# EAGLE design display_driver (EAGLE 7.2.0)
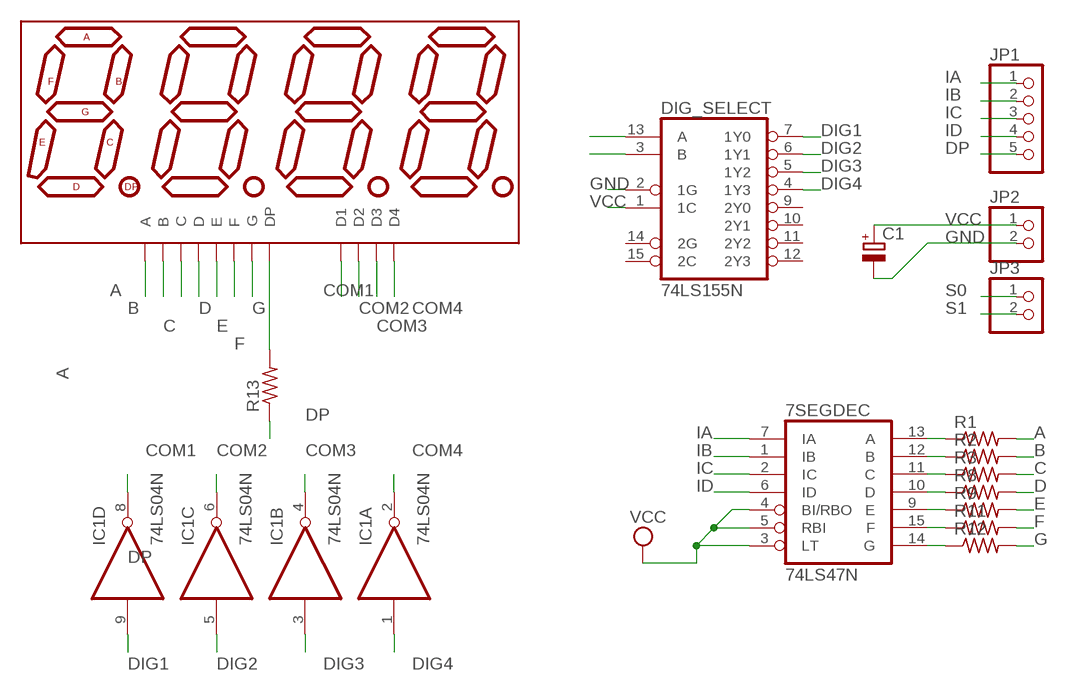
[diagram p0: schematic, sheet 1]

## Parts
7SEGDEC  74LS47N  [DIL16]
C1  CPOL-EUE2-5  [E2-5]
DIG_SELECT  74LS155N  [DIL16]
DISP1  7-SEGMENT-4DIGIT-COUNTERCL5642BH-33  [4DIG_CA]
IC1  74LS04N  [DIL14]
JP1  PINHD-1X5  [1X05]
JP2  PINHD-1X2  [1X02]
JP3  PINHD-1X2  [1X02]
R1  R-US_0204/7  [0204/7]
R2  R-US_0204/7  [0204/7]
R3  R-US_0204/7  [0204/7]
R8  R-US_0204/7  [0204/7]
R9  R-US_0204/7  [0204/7]
R11  R-US_0204/7  [0204/7]
R12  R-US_0204/7  [0204/7]
R13  R-US_0204/7  [0204/7]

## Nets
A: DISP1.A R1.2
B: DISP1.B R2.2
C: DISP1.C R3.2
COM1: DISP1.COM1(D1) IC1.8(D:O)
COM2: DISP1.COM2(D2) IC1.6(C:O)
COM3: DISP1.COM3(D3) IC1.4(B:O)
COM4: DISP1.COM4(D4) IC1.2(A:O)
D: DISP1.D R8.2
DIG1: DIG_SELECT.7(1Y0) IC1.9(D:I)
DIG2: DIG_SELECT.6(1Y1) IC1.5(C:I)
DIG3: DIG_SELECT.5(1Y2) IC1.3(B:I)
DIG4: DIG_SELECT.4(1Y3) IC1.1(A:I)
DP: JP1.5 R13.1
E: DISP1.E R9.2
F: DISP1.F R11.2
G: DISP1.G R12.2
GND: C1.- DIG_SELECT.2(1G) JP2.2
IA: 7SEGDEC.7(IA) JP1.1
IB: 7SEGDEC.1(IB) JP1.2
IC: 7SEGDEC.2(IC) JP1.3
ID: 7SEGDEC.6(ID) JP1.4
N$3: 7SEGDEC.15(F) R11.1
N$4: DISP1.DP R13.2
N$5: 7SEGDEC.13(A) R1.1
N$9: 7SEGDEC.12(B) R2.1
N$10: 7SEGDEC.11(C) R3.1
N$11: 7SEGDEC.10(D) R8.1
N$12: 7SEGDEC.9(E) R9.1
N$13: 7SEGDEC.14(G) R12.1
S0: DIG_SELECT.13(A) JP3.1
S1: DIG_SELECT.3(B) JP3.2
VCC: 7SEGDEC.3(LT) 7SEGDEC.4(BI/RBO) 7SEGDEC.5(RBI) C1.+ DIG_SELECT.1(1C) JP2.1
Unconnected: DIG_SELECT.9(2Y0) DIG_SELECT.10(2Y1) DIG_SELECT.11(2Y2) DIG_SELECT.12(2Y3) DIG_SELECT.14(2G) DIG_SELECT.15(2C) IC1.10(E:O) IC1.11(E:I) IC1.12(F:O) IC1.13(F:I)

## Power pins joined to a net without a drawn wire
GND: 7SEGDEC.8(GND) DIG_SELECT.8(GND) IC1.7(P:GND)
VCC: 7SEGDEC.16(VCC) DIG_SELECT.16(VCC) IC1.14(P:VCC)

## Library data of the parts
7SEGDEC = 74xx-eu:74*47: BCD to seven segment DECODER/DRIVER Source: http://www.ee.washington.edu/stores/DataSheets/74ls/74ls47.pdf
C1 = rcl:CPOL-EU: POLARIZED CAPACITOR, European symbol
DIG_SELECT = 74xx-eu:74*155: Dual 2-line to 4-line data DECODER/DEMULTIPLEXER
DISP1 = SparkFun-Displays:7-SEGMENT-4DIGIT-COUNTER
IC1 = 74xx-eu:74*04: Hex INVERTER
JP1 = pinhead:PINHD-1X5: PIN HEADER
JP2 JP3 = pinhead:PINHD-1X2: PIN HEADER
R1-R3 R8 R9 R11-R13 = resistor:R-US_: RESISTOR, American symbol

## Board
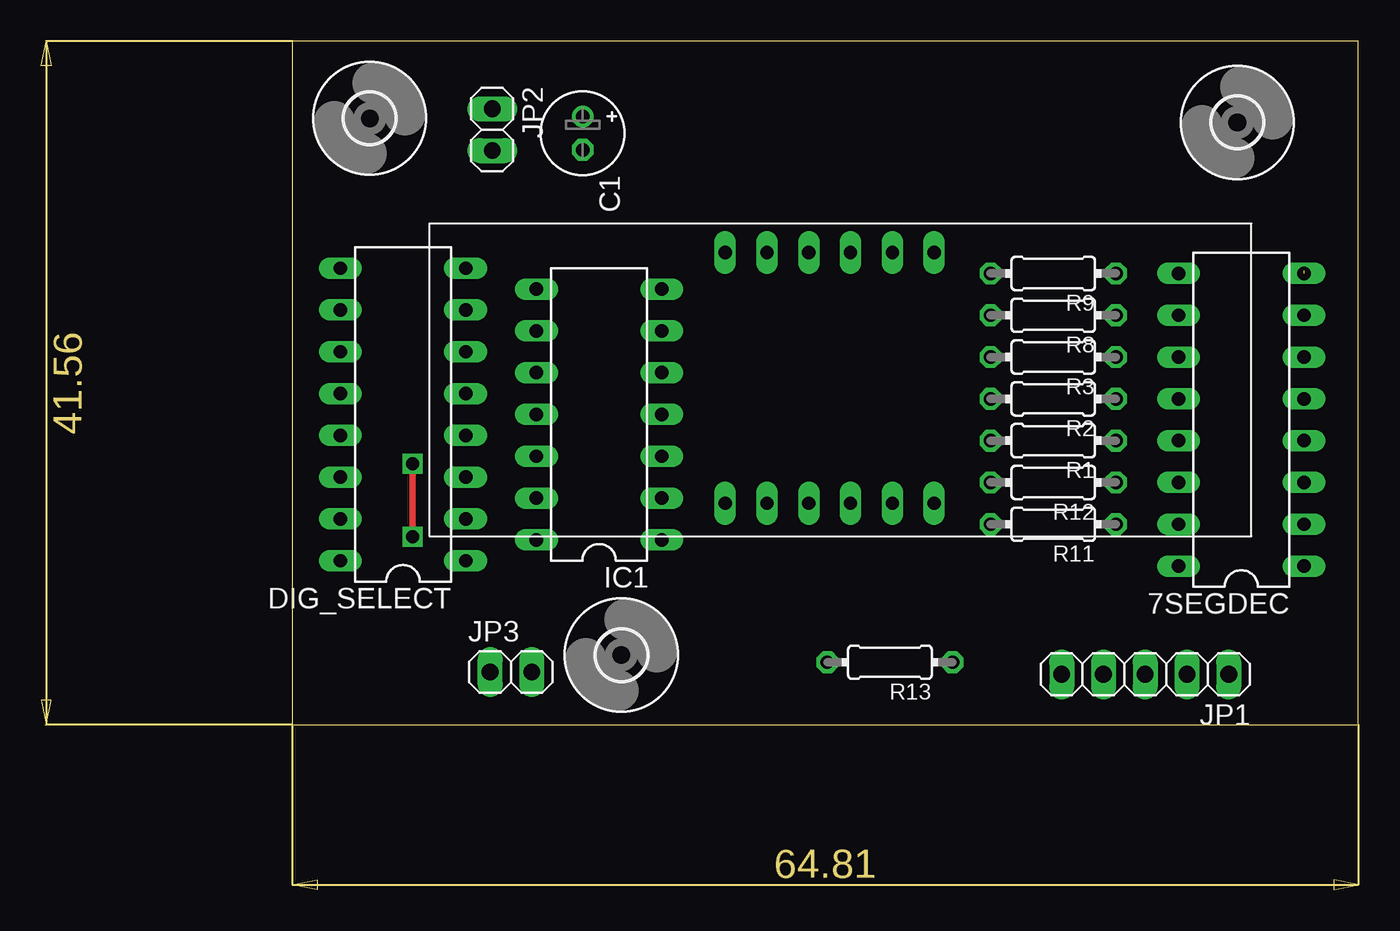
[diagram p1: board, top side]
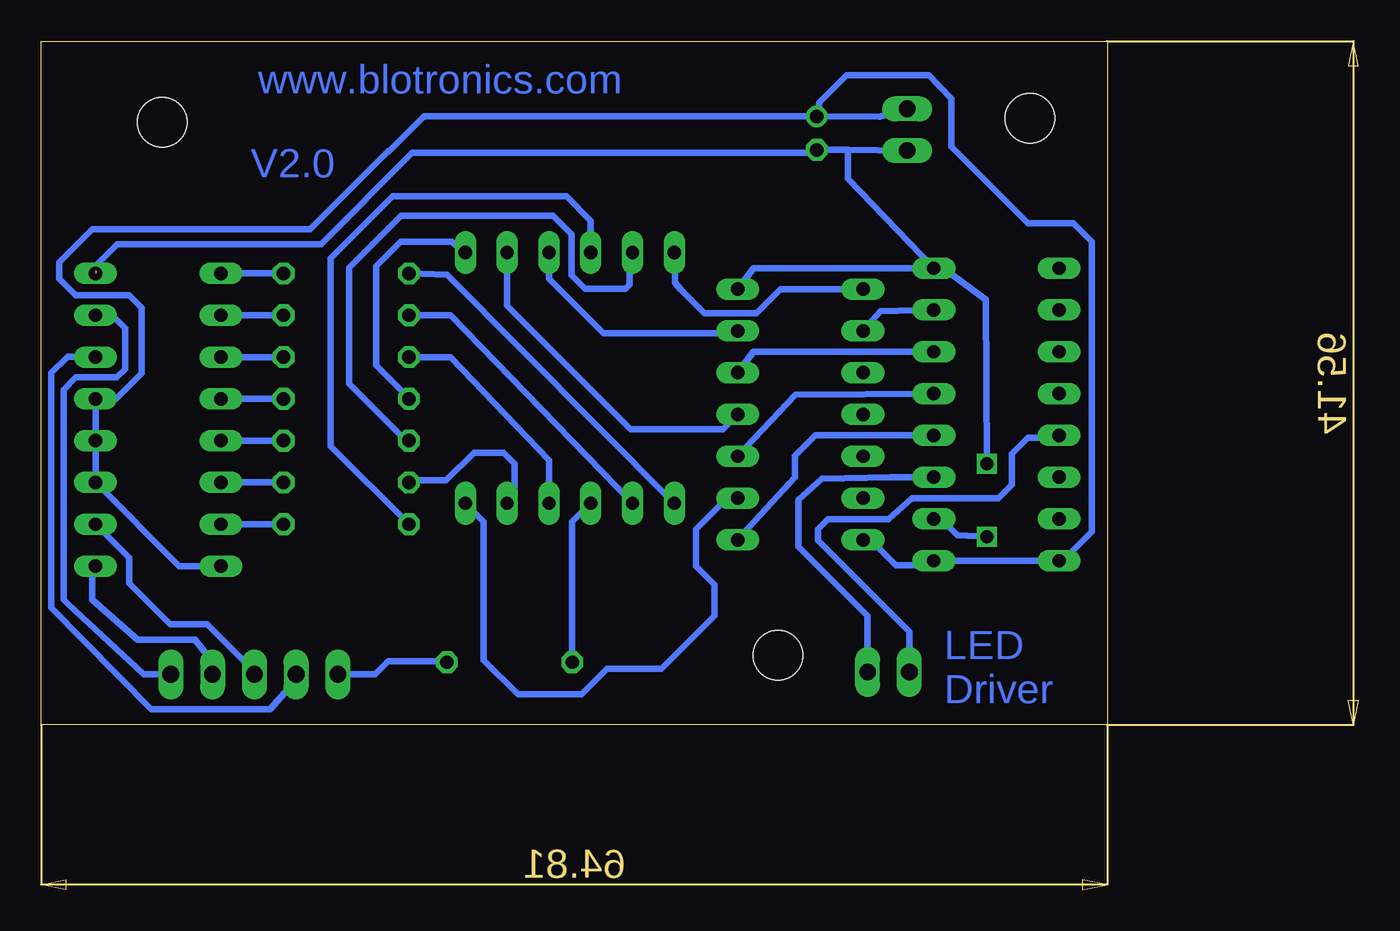
[diagram p2: board, bottom side, seen from below]

Size 64.81 x 41.56 mm. Coordinates in mm from the lower left corner, seen from the top.
Outline: 0,0 64.81,0 64.81,41.56 0,41.56 0,0
Copper layers (1*16): Top 0.035mm / dielectric 1.5mm / Bottom 0.035mm
Design rules "default": minimum track width 10mil, minimum drill 24mil, track to track 8mil, track to pad 8mil, pad to pad 8mil, via to via 8mil, smd to smd 8mil, copper to edge 40mil, drill to drill 8mil, minimum pad ring 10mil, minimum via ring 8mil, stop-mask expansion 4mil, vias tented up to drill 0mil, thermal gap 10mil

### Footprints (pad centres in the part's own frame; a part is rotated, then mirrored left to right if it is on the bottom)
DIL16 = drill 0.813 long: 1 -8.89,-3.81; 2 -6.35,-3.81; 3 -3.81,-3.81; 4 -1.27,-3.81; 5 1.27,-3.81; 6 3.81,-3.81; 7 6.35,-3.81; 8 8.89,-3.81; 9 8.89,3.81; 10 6.35,3.81; 11 3.81,3.81; 12 1.27,3.81; 13 -1.27,3.81; 14 -3.81,3.81; 15 -6.35,3.81; 16 -8.89,3.81
E2-5 = drill 0.813 pad 1.27: + -1.016,0 | drill 0.813 pad 1.27 octagon: - 1.016,0
4DIG_CA = drill 0.8 long: A 2.54,15.24; B 12.7,15.24; C 7.62,0; COM1 0,15.24; COM2 7.62,15.24; COM3 10.16,15.24; COM4 12.7,0; D 2.54,0; DP 5.08,0; E 0,0; F 5.08,15.24; G 10.16,0
DIL14 = drill 0.813 long: 1 -7.62,-3.81; 2 -5.08,-3.81; 3 -2.54,-3.81; 4 0,-3.81; 5 2.54,-3.81; 6 5.08,-3.81; 7 7.62,-3.81; 8 7.62,3.81; 9 5.08,3.81; 10 2.54,3.81; 11 0,3.81; 12 -2.54,3.81; 13 -5.08,3.81; 14 -7.62,3.81
1X05 = drill 1.016 long: 1 -5.08,0; 2 -2.54,0; 3 0,0; 4 2.54,0; 5 5.08,0
1X02 = drill 1.016 long: 1 -1.27,0; 2 1.27,0
0204/7 = drill 0.813 octagon: 1 -3.81,0; 2 3.81,0
3,0 = hole 3: 0,0

### Placement (x,y rotation side)
7SEGDEC  57.69,18.55 90 top
C1  17.65,35.97 270 top
DIG_SELECT  6.72,18.87 90 top
DISP1  26.32,13.47 0 top
IC1  18.65,18.87 90 top
JP1  51.85,3.08 180 top
JP2  12.15,36.18 270 top
JP3  13.29,3.22 0 top
R1  46.26,17.28 180 top
R2  46.26,19.82 180 top
R3  46.26,22.36 180 top
R8  46.26,24.9 180 top
R9  46.26,27.44 180 top
R11  46.26,12.2 180 top
R12  46.26,14.74 180 top
R13  36.33,3.81 180 top
U$1  [3,0]  57.45,36.62 0 top
U$2  [3,0]  4.7,36.87 0 top
U$3  [3,0]  20,4.25 0 top

### Tracks (layer width: path | path; a pad name or v marks a point on that pad's centre or on a via)
A
  Bottom 0.406: R1.2 42.61,17.28 46.08,20.75 46.08,27.79 42.92,30.95 33.7,30.95 32.58,29.82 32.58,27.35 31.75,26.52 29.28,26.52 29.05,26.75 29.05,28.52 DISP1.A
B
  Bottom 0.406: R2.2 42.45,19.87 44.45,21.87 44.45,27.87 42.95,29.37 39.87,29.37 DISP1.B
C
  Bottom 0.406: DISP1.C 33.94,16.09 39.91,22.36 R3.2
COM1
  Bottom 0.406: IC1.8 19.86,26.49 21.32,25.02 24.47,25.02 25.9,26.45 26.28,26.88 DISP1.COM1
COM2
  Bottom 0.406: DISP1.COM2 33.94,27.13 30.62,23.82 22.59,23.82 IC1.6
COM3
  Bottom 0.406: DISP1.COM3 36.47,25.47 28.97,17.97 23.36,17.97 IC1.4
COM4
  Bottom 0.406: IC1.2 23.11,13.79 25,11.89 25,9.64 23.87,8.52 23.87,6.64 27.1,3.42 30.4,3.42 31.95,1.87 35.83,1.87 37.9,3.95 37.9,12.36 DISP1.COM4
D
  Bottom 0.406: DISP1.D 39.91,24.9 R8.2
DIG1
  Bottom 0.406: DIG_SELECT.7 13.79,25.14 IC1.9
DIG2
  Bottom 0.406: DIG_SELECT.6 21.49,22.68 IC1.5
DIG3
  Bottom 0.406: DIG_SELECT.5 18.95,20.07 IC1.3
DIG4
  Bottom 0.406: IC1.1 18.96,15.04 18.96,16.36 17.72,17.6 11.65,17.6 DIG_SELECT.4
DP
  Bottom 0.406: JP1.5 44.49,3.08 43.7,3.87 40.2,3.87 R13.1
E
  Bottom 0.406: DISP1.E 26.39,13.54 40.14,27.36 R9.2
F
  Bottom 0.406: R11.2 47.2,16.95 47.2,28.37 43.45,32.12 32.88,32.12 31.39,30.64 DISP1.F
G
  Bottom 0.406: DISP1.G 36.03,13.63 36.03,15.87 36.7,16.54 38.5,16.54 40.17,14.87 42.58,14.87 R12.2
GND  (via drill 0.8)  (1 unrouted)
  Top 0.406: v7.3,11.45 v7.3,15.87
  Bottom 0.406: DIG_SELECT.8 21.49,27.76 IC1.7 | 15.76,34.95 C1.- 17.83,34.77 42.25,34.77 47.8,29.22 60.17,29.22 61.5,27.89 61.5,27.6 | 15.76,34.95 JP2.2 | 15.76,34.95 15.76,33.21 DIG_SELECT.8 | DIG_SELECT.2 10.02,12.45 9.1,11.52 v7.3,11.45 | v7.3,15.87 7.38,25.85 9.7,27.57 11.47,27.57 DIG_SELECT.8
IA
  Bottom 0.406: 61.53,24.87 7SEGDEC.7 61.47,24.87 60.45,24.87 59.7,24.12 59.7,21.62 60.2,21.12 62.7,21.12 63.45,20.37 63.45,7.62 63.2,7.37 58.56,3.08 JP1.1
IB
  Bottom 0.406: JP1.2 54.39,3.81 55.45,5.17 58.95,5.17 61.7,7.62 61.7,9.46 7SEGDEC.1
IC
  Bottom 0.406: JP1.3 51.85,3.27 54.7,6.12 56.95,6.12 59.45,8.62 59.45,10.15 7SEGDEC.2
ID
  Bottom 0.406: JP1.4 49.31,2.76 50.88,0.97 58.12,0.97 64.2,7.12 64.2,21.39 63.2,22.37 7SEGDEC.6
N$3
  Bottom 0.406: 7SEGDEC.15 R11.1
N$4
  Bottom 0.406: R13.2 32.52,12.35 DISP1.DP
N$5
  Bottom 0.406: 7SEGDEC.13 R1.1
N$9
  Bottom 0.406: 7SEGDEC.12 R2.1
N$10
  Bottom 0.406: 7SEGDEC.11 R3.1
N$11
  Bottom 0.406: 7SEGDEC.10 R8.1
N$12
  Bottom 0.406: 7SEGDEC.9 R9.1
N$13
  Bottom 0.406: 7SEGDEC.14 R12.1
S0
  Bottom 0.406: JP3.1 12.02,5.67 17.57,11.22 17.57,11.89 16.97,12.5 13.3,12.5 11.87,13.77 6.62,13.77 5.8,14.6 5.8,16.47 4.82,17.45 4.04,17.45 DIG_SELECT.13
S1
  Bottom 0.406: JP3.2 14.56,6.63 18.78,10.85 18.78,13.7 17.35,14.97 13.22,15.04 DIG_SELECT.3
VCC
  Bottom 0.406: 7SEGDEC.16 56.42,9.66 7SEGDEC.3 7SEGDEC.4 7SEGDEC.5 60.25,19.82 58.7,21.37 58.7,25.37 59.45,26.12 62.7,26.12 63.7,27.12 63.7,28.12 61.7,30.12 48.45,30.12 43.7,34.87 43.65,34.87 41.53,36.99 C1.+ | IC1.14 14.38,11.25 12.85,9.72 10.57,9.72 DIG_SELECT.1 DIG_SELECT.16 2.69,9.98 0.93,11.75 0.93,29.37 2.05,30.5 4.82,30.5 9.47,35.14 9.47,38.07 10.82,39.5 15.85,39.5 17.5,37.84 C1.+ | JP2.1 13.84,36.97 C1.+

### Text on the board
Bottom: www.blotronics.com | V2.0 | LED / Driver